# EAGLE design mag_hmc5883l_v11 (EAGLE 5.11)
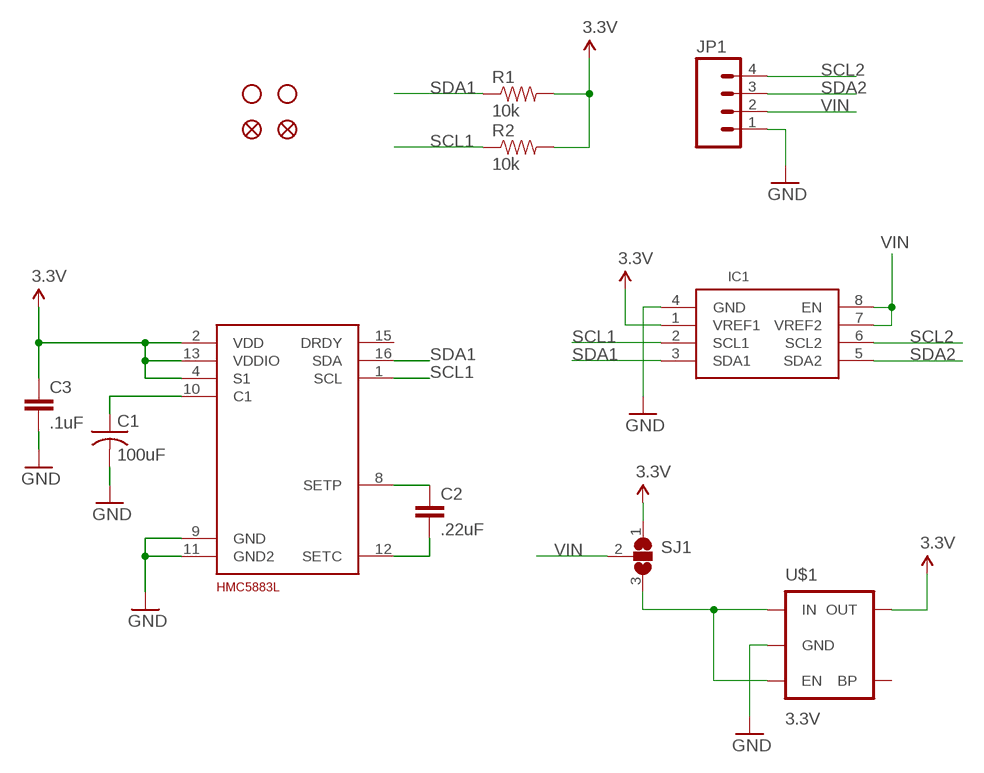
[diagram p0: schematic, sheet 1]

## Parts
C1  100uF  C-USC1210K  [C1210K]
C2  .22uF  CAP0402  [C0402]
C3  .1uF  CAP0402  [C0402]
IC1  PCA9306DC  [VSSOP8]
JP1  M04PTH  [1X04]
JP2  FIDUCIAL1X2  [FIDUCIAL-1X2]
JP3  FIDUCIAL1X2  [FIDUCIAL-1X2]
R1  10k  RESISTOR0402  [C0402]
R2  10k  RESISTOR0402  [C0402]
SJ1  SOLDERJUMPER_2WAYS  [SJ_3]
U$1  3.3V  V_REG_LDOSMD  [SOT23-5]
U$2  STAND-OFF  [STAND-OFF]
U$3  STAND-OFF  [STAND-OFF]
U$4  HMC5883L  [LPCC16]

## Nets
3.3V: C3.1 IC1.1(VREF1) R1.2 R2.2 SJ1.1 U$1.5(OUT) U$4.2(VDD) U$4.4(S1) U$4.13(VDDIO)
GND: C1.2 C3.2 IC1.4(GND) JP1.1 U$1.2(GND) U$4.9(GND) U$4.11(GND2)
N$4: SJ1.3 U$1.1(IN) U$1.3(EN)
N$5: C2.1 U$4.8(SETP)
N$8: C2.2 U$4.12(SETC)
N$10: C1.1 U$4.10(C1)
SCL1: IC1.2(SCL1) R2.1 U$4.1(SCL)
SCL2: IC1.6(SCL2) JP1.4
SDA1: IC1.3(SDA1) R1.1 U$4.16(SDA)
SDA2: IC1.5(SDA2) JP1.3
VIN: IC1.7(VREF2) IC1.8(EN) JP1.2 SJ1.2
Unconnected: U$1.4(BP) U$4.15(DRDY)

## Library data of the parts
C1 = rcl:C-US: CAPACITOR, American symbol
C2 C3 = DIYdrones3:CAP: Capacitor Standard 0603 ceramic capacitor, and 0.1" leaded capacitor.
IC1 = DIYdrones_082610:PCA9306DC
JP1 = SparkFun:M04: Header 4 Standard 4-pin 0.1" header. Use with straight break away headers (SKU : PRT-00116), right angle break away headers (PRT-00553), swiss pins (PRT-00743), machine pins (PRT-00117), and female headers (PRT-00115). Molex polarized connector foot print use with SKU : PRT-08231 with associated crimp pins and housings.
JP2 JP3 = SparkFun:FIDUCIAL: Fiducial Alignment Points Various fiducial points for machine vision alignment.
R1 R2 = DIYdrones3:RESISTOR: Resistor Basic schematic elements and footprints for 0603, 1206, and PTH 1/10th watt (small) resistors.
SJ1 = DIYdrones3:SOLDERJUMPER_2WAY: Solder Jumper 2 way solder jumper
U$1 = DIYdrones3:V_REG_LDO: Voltage Regulator LDO Standard 150mA LDO voltage regulator in SOT-23 layout. Micrel part MIC5205. BP (by-pass) pin is used to lower output noise with 470pF cap.
U$2 U$3 = DIYdrones3:STAND-OFF: Stand Off This is the mechanical footprint for a #4 phillips button head screw. Use the keepout ring to avoid running the screw head into surrounding components. SKU : PRT-00447
U$4 = SparkFun:HMC5883L: HMC5883L 3-axis digital compass IC

## Board
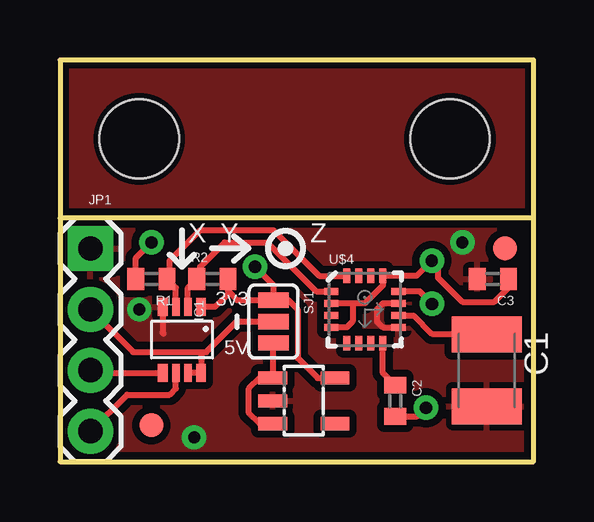
[diagram p1: board, top side]
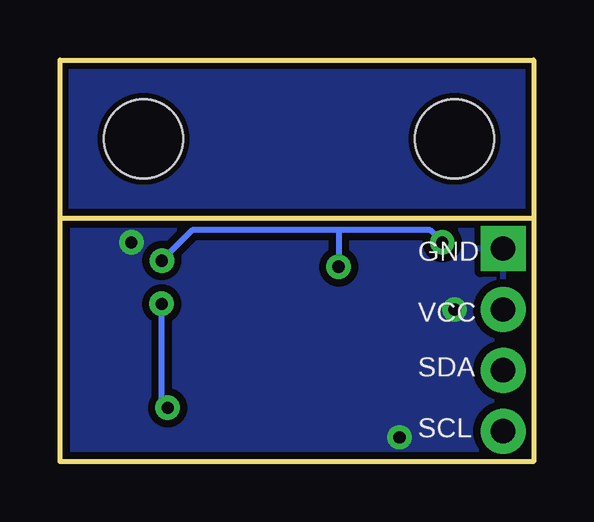
[diagram p2: board, bottom side, seen from below]

Size 19.74 x 16.75 mm. Coordinates in mm from the lower left corner, seen from the top.
Outline: 0,10.16 0,16.75 19.74,16.75 19.74,10.16
Outline: 0,0 19.74,0 19.74,10.15 0,10.15 0,0
Copper layers (1*16): Top 0.035mm / dielectric 1.5mm / Bottom 0.035mm
Design rules "SparkFun": minimum track width 8mil, minimum drill 20mil, track to track 8mil, track to pad 8mil, pad to pad 8mil, via to via 8mil, smd to smd 8mil, copper to edge 10mil, drill to drill 8mil, minimum pad ring 12mil, minimum via ring 10mil, stop-mask expansion 4mil, vias tented up to drill 25mil, thermal gap 10mil

### Footprints (pad centres in the part's own frame; a part is rotated, then mirrored left to right if it is on the bottom)
C1210K = smd 1.5 x 2.9: 1 -1.5,0; 2 1.5,0
C0402 = smd 0.7 x 0.9: 1 -0.65,0; 2 0.65,0
VSSOP8 = smd 0.75 x 0.4: 1 -1.375,0.8; 4 -1.375,-0.8; 5 1.375,-0.8; 8 1.375,0.8 | smd 0.75 x 0.3: 2 -1.375,0.25; 3 -1.375,-0.25; 6 1.375,-0.25; 7 1.375,0.25
1X04 = drill 1.016 pad 1.88 square: 1 0,0 | drill 1.016 pad 1.88 round: 2 2.54,0; 3 5.08,0; 4 7.62,0
FIDUCIAL-1X2 = smd 1 x 1: 1 0,0
SJ_3 = smd 0.635 x 1.27: 1 -0.889,0; 2 0,0; 3 0.889,0
SOT23-5 = smd 0.55 x 1.2: 1 -0.95,-1.3; 2 0,-1.3; 3 0.95,-1.3; 4 0.95,1.3; 5 -0.95,1.3
STAND-OFF = hole 3.302: 0,0
LPCC16 = smd 0.6 x 0.3: 1 -1.4,0.75; 2 -1.4,0.25; 3 -1.4,-0.25; 4 -1.4,-0.75; 9 1.4,-0.75; 10 1.4,-0.25; 11 1.4,0.25; 12 1.4,0.75 | smd 0.3 x 0.6: 5 -0.75,-1.4; 6 -0.25,-1.4; 7 0.25,-1.4; 8 0.75,-1.4; 13 0.75,1.4; 14 0.25,1.4; 15 -0.25,1.4; 16 -0.75,1.4

### Placement (x,y rotation side)
C1  17.78,3.81 270 top
C2  13.97,2.54 270 top
C3  18.03,7.62 180 top
IC1  5.08,5.08 270 top
JP1  1.27,8.89 270 top
JP2  18.54,8.89 0 top
JP3  3.81,1.52 0 top
R1  3.81,7.62 180 top
R2  6.35,7.62 0 top
SJ1  8.89,5.84 270 top
U$1  10.16,2.54 270 top
U$2  3.3,13.46 0 top
U$3  16.26,13.46 0 top
U$4  12.7,6.35 0 top

### Tracks (layer width: path | path; a pad name or v marks a point on that pad's centre or on a via)
3.3V  (via drill 0.51)
  Top 0.254: IC1.1 6.46,6.46 7,7 7,7.11 | 7,7.11 R2.2 | SJ1.1 7.38,6.73 7,7.11 | R1.2 3.16,8.49 v3.81,9.14 | SJ1.1 8.89,7.37 v8.13,8.13 | U$1.5 10.73,3.49 9.91,4.32 9.91,6.35 9.53,6.73 SJ1.1 | C3.1 18.71,7.28 18.09,6.66 16.76,6.66 15.75,7.68 15.75,8.13 v15.49,8.38 14.86,7.75 U$4.13 | U$4.13 13.46,7.7 | U$4.13 13.46,7.74 | U$4.4 11.95,5.6 12.19,5.84 12.19,6.6 | 12.19,6.6 12.7,6.6 13.45,7.35 U$4.13 | 12.19,6.6 U$4.2
  Bottom 0.254: v3.81,9.14 4.32,9.65 8.13,9.65 | 8.13,9.65 14.22,9.65 v15.49,8.38 | 8.13,9.65 v8.13,8.13
GND  (via drill 0.51)
  Top 0.254: IC1.4 4.28,5.37 4.32,5.33 | U$4.9 13.45,5.6 13.21,5.84 13.21,6.35 13.46,6.6 U$4.11
  other vias: 3.3,6.35 16.76,9.14 5.59,1.02
  pour Top (isolate 0.305): 0,9.91 19.81,9.91 19.81,0.25 0,0.25
  pour Top: 12.7,1.1 15.24,1.1 15.24,0.59 12.7,0.59
  pour Bottom (isolate 0.305): 0,9.91 19.81,9.91 19.81,0.25 0,0.25
N$4
  Top 0.254: SJ1.3 8.89,3.52 U$1.1 8.32,3.49 7.87,3.05 7.87,2.03 8.32,1.59 U$1.3
N$5
  Top 0.254: U$4.8 13.45,3.7 C2.1
N$6
  pour Top: 0,16.76 19.81,16.76 19.81,10.67 0,10.67
N$7
  pour Bottom: 0,16.76 19.81,16.76 19.81,10.67 0,10.67
N$8  (via drill 0.51)
  Top 0.254: C2.2 14.89,1.89 v15.25,2.25 | U$4.12 14.98,7.1 v15.5,6.58
  Bottom 0.254: v15.25,2.25 15.5,2.5 v15.5,6.58
N$10
  Top 0.254: 17.62,5.5 C1.1 17.75,5.33 15.49,5.33 14.73,6.1 U$4.10
SCL1
  Top 0.254: IC1.2 5.33,7.25 R2.1 5.84,7.76 5.84,8.13 6.86,9.14 8.64,9.14 10.68,7.1 U$4.1
SCL2
  Top 0.254: IC1.6 4.83,3.05 4.57,2.79 2.79,2.79 JP1.4
SDA1
  Top 0.254: IC1.3 4.83,7.25 R1.1 4.57,7.73 4.57,8.38 5.84,9.65 8.89,9.65 10.79,7.75 U$4.16 11.95,7.71
SDA2
  Top 0.254: IC1.5 1.38,3.71 JP1.3
VIN
  Top 0.254: 5.84,4.57 3.05,4.57 JP1.2 | 5.84,4.57 6.1,4.57 7.37,5.84 SJ1.2 | 5.84,4.57 5.88,4.53 IC1.8 IC1.7

### Text on the board
tPlace: X | Y | Z | 3v3 | 5V
bPlace: GND | VCC | SDA | SCL